# Altium project New Member Design Project.PrjPcb
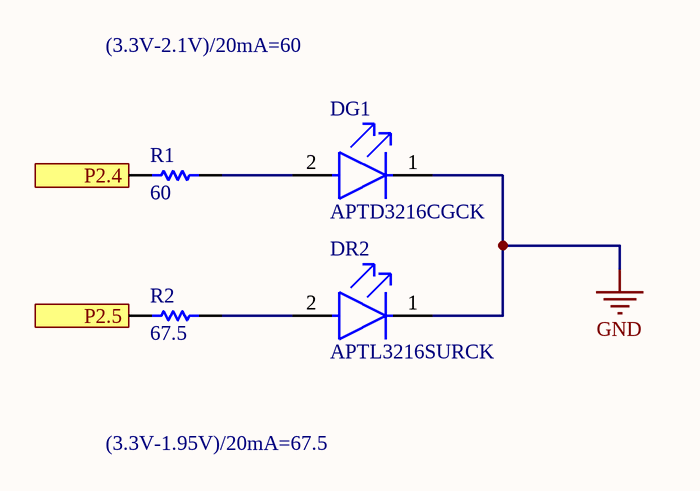
[diagram p0: Sheet1.SchDoc]
3 sheets, 7 parts. Net scope: flat (ports and power ports of the same name join across sheets).
Sheets:
  Sheet1.SchDoc
  Sheet2.SchDoc
  Sheet3.SchDoc

## Sheet Sheet1.SchDoc
size A

### Parts
DG1  APTD3216CGCK  [FP-APTD3216CGCK-MFG]
DR2  APTL3216SURCK  [FP-APTL3216SURCK-MFG]
R1  60  [RESC2013X70X40ML20T20]
R2  67.5  [RESC2013X70X40ML20T20]

### Ports
P2.4, P2.5

### Nets
GND: DG1.1(C) DR2.1(C)
Net*_12: R1.1 ; port P2.4
Net*_13: R2.1 ; port P2.5
NetDG1_2: DG1.2(A) R1.2
NetDR2_2: DR2.2(A) R2.2

### Notes on the sheet
- (3.3V-2.1V)/20mA=60
- (3.3V-1.95V)/20mA=67.5

### Library data of the parts
DG1 = CMP-44529-000049-1: LED GREEN CLEAR 2SMD; Forward Voltage: 2.1V; Forward Current: 20mA; Luminous Intensity: 300mcd; Number of LEDs: 1; Dominant Wavelength: 570nm; Viewing Angle: 50°; Lead Free: Lead Free; Lens Color: Clear; Mount: Surface Mount; Package Quantity: 2000; Height: 1.8mm; Number of Pins: 2; Test Current: 20mA; Case Code (Metric): 3216; Case/Package: 1206; Case Code (Imperial): 1206; Illumination Color: Green; Color: Green; Width: 1.6mm; Packaging: Tape and Reel; Min Operating Temperature: -40°C; Lens Style: Clear; Max Operating Temperature: 85°C; Length: 3.2mm
DR2 = CMP-44529-000007-1: LED RED CLEAR CHIP SMD; Manufacturer: Kingbright; Forward Voltage: 1.95V; Led Orientation: Top View; Peak Emmision Wavelength: 645nm; Wavelength: 630nm; Viewing Angle: 80°; Max Junction Temp: +115°C; Forward Current: 20mA; Power Dissipation: 75mW; Luminous Intensity: 550mcd; Reverse Voltage: 5V; Height: 1.2mm; Temperature: -40°C to +85°C; Device Class L3: unset; Device Class L2: LEDs; Colour: Red; ComponentLink2URL: http://www.kingbrightusa.com/images/catalog/SPEC/APTL3216SURCK.pdf; ComponentLink2Description: Datasheet; RoHS: TRUE; Lead Free: Yes; Temperature Range Low: -40°C; Temperature Range High: +85°C; Device Class L1: Optoelectronics; Mouser Description: APTL3216SURCK Red LED; 630 nm 3216 (1206); Round Lens SMD package; Package: APTL3216SURCK; Manufacturer Part Number: APTL3216SURCK; Octopart: https://octopart.com/aptl3216surck-kingbright-5355676; Digikey Description: LED RED CLEAR CHIP SMD; Automotive: No; Category: Diode
R1 R2 = CMP-2001-00270-1: Part Number: ERJ-6ENF66R5V; Manufacturer: Panasonic

## Sheet Sheet2.SchDoc
size A
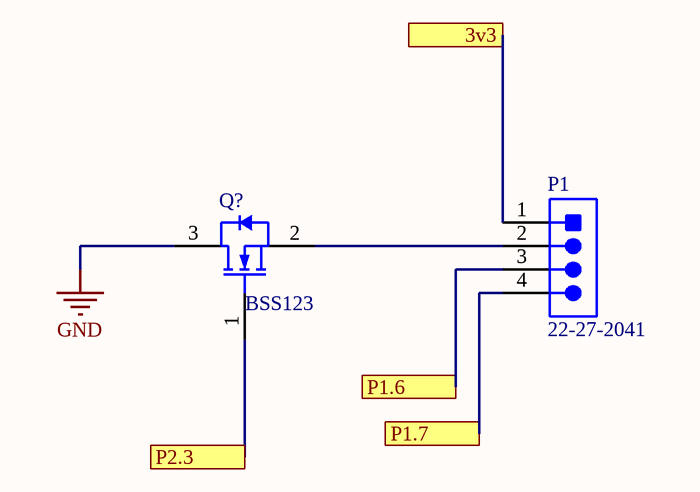
[diagram p1: Sheet2.SchDoc]

### Parts
P1  22-27-2041  [MOLX-22-27-2041_V]
Q?  BSS123  [FAIR-SOT23-3_V]

### Ports
3v3, P1.6, P1.7, P2.3

### Nets
GND: Q?.3(D)
Net*_1: P1.1 ; port 3v3
Net*_11: Q?.1(G) ; port P2.3
Net*_14: P1.3 ; port P1.6
Net*_15: P1.4 ; port P1.7
NetP1_2: P1.2 Q?.2(S)

### Library data of the parts
P1 = CMP-2000-05243-1: Male Header, Pitch 2.54 mm, 1 x 4 Position, Height 11.7 mm, Tail Length 3.56 mm, RoHS, Bulk; Manufacturer: Molex; Voltage rating: 250V; Current rating: 4A; Datasheet Version: Rev. F, 06/2009; Operating temperature: 0degCto+75degC; Contact material: Tinplatedbrass; Manufacturer URL: http://www.molex.com/; Housing material: Nylon(UL94V-0); Datasheet URL: http://www.molex.com/pdm_docs/sd/022272041_sd.pdf
Q? = CMP-2000-04934-1: N-Channel Logic Level Enhancement Mode Field Effect Transistor, 1.7 V, -55 to 150 degC, 3-Pin SOT-23, RoHS, Tape and Reel; Manufacturer: Fairchild; Channel Type: N; Typical Turn-Off Delay Time: 17ns; Maximum Continuous Drain Current: 0.17A; Rad Hard: No; Typical Rise Time: 9ns; Typical Fall Time: 2.4ns; Maximum Gate Source Voltage: ±20V; Maximum Drain Source Voltage: 100V; Typical Turn-On Delay Time: 1.7ns; RDS-on: 6000@10VmOhm; Package Version: Rev. 12, 03/2016; Packaging: Tape&Reel; Package Reference: SOT23-3; Channel Mode: Enhancement; Operating Temperature: -55to150degC; Package Description: 3-Pin Small Outline Transistor, Body 2.92 x 1.325 mm, Pitch 0.95 mm; Category: MOSFET; Datasheet Version: Jun-03; Datasheet URL: https://www.fairchildsemi.com/datasheets/BS/BSS123.pdf; Manufacturer URL: https://www.fairchildsemi.com/; Mounting: SurfaceMount; Package: 3SOT-23; Package URL: http://www.fairchildsemi.com/dwg/MA/MA03D.pdf

## Sheet Sheet3.SchDoc
size A
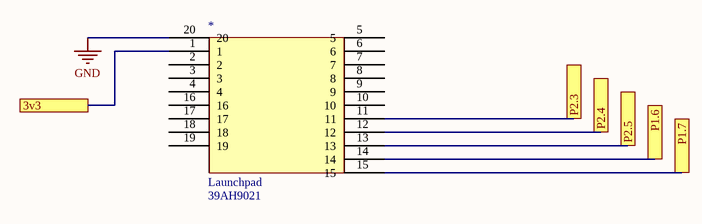
[diagram p2: Sheet3.SchDoc]

### Parts
*  Launchpad  Supplier Part Number 1: 39AH9021  [MSP430 Launchpad]

### Ports
3v3, P1.6, P1.7, P2.3, P2.4, P2.5

### Nets
GND: *.20
Net*_1: *.1 ; port 3v3
Net*_11: *.11 ; port P2.3
Net*_12: *.12 ; port P2.4
Net*_13: *.13 ; port P2.5
Net*_14: *.14 ; port P1.6
Net*_15: *.15 ; port P1.7

Not connected (* = marked no-connect by the designer): * 2 3 4 5 6 7 8 9 10 16 17 18 19

### Library data of the parts
* = Launchpad: MSP430G2XX, LAUNCHPAD, FLASH EMULATION, DEV KIT; Manufacturer: Texas Instruments; Manufacturer Part Number: MSP-EXP430G2; Core Architecture: MSP430; Evaluation Kit: Yes; Interface: USB; Data Bus Width: 16b; Number of Bits: 16; Supplier 1: Newark; RoHS: Yes; Category: Embedded Processors and Controllers; Mount: Socket; Number of Pins: 0.7; Weight: 0.22lb; Packaging: Bulk; Package Quantity: 1; Length: 3.94inch; Height: 1.97inch; Width: 3.94inch; Radiation Hardening: No; REACH SVHC: No SVHC; ComponentLink1URL: https://datasheet.ciiva.com/2398/slay017-2398228.pdf?src-supplier=Digi-Key; ComponentLink1Description: https://datasheet.ciiva.com/2398/slay017-2398228.pdf?src-supplier=Digi-Key; ComponentLink2URL: https://datasheet.ciiva.com/27059/2207275-27059764.pdf?src-supplier=Jameco; ComponentLink2Description: https://datasheet.ciiva.com/27059/2207275-27059764.pdf?src-supplier=Jameco; ComponentLink3URL: https://datasheet.ciiva.com/20167/73-4724-20167738.pdf?src-supplier=Rapid+Electronics; ComponentLink3Description: https://datasheet.ciiva.com/20167/73-4724-20167738.pdf?src-supplier=Rapid+Electronics; ComponentLink4URL: https://datasheet.ciiva.com/26344/414784-da-01-en-launchpad-devel-tool-msp-exp430g2-tid-26344585.pdf?src-supplier=Conrad; ComponentLink4Description: https://datasheet.ciiva.com/26344/414784-da-01-en-launchpad-devel-tool-msp-exp430g2-tid-26344585.pdf?src-supplier=Conrad

## Nets that join several sheets
GND: Sheet1 (DG1.1 DR2.1), Sheet2 (Q?.3), Sheet3 (*.20)
Net*_1: Sheet2 (P1.1), Sheet3 (*.1)
Net*_11: Sheet2 (Q?.1), Sheet3 (*.11)
Net*_12: Sheet1 (R1.1), Sheet3 (*.12)
Net*_13: Sheet1 (R2.1), Sheet3 (*.13)
Net*_14: Sheet2 (P1.3), Sheet3 (*.14)
Net*_15: Sheet2 (P1.4), Sheet3 (*.15)